# EAGLE schematic Zigzag ISP connector (EAGLE 7.6.0)
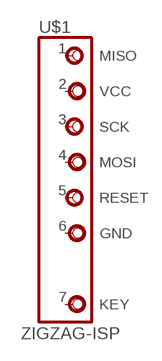
[diagram p0: schematic, sheet 1]

## Parts
U$1  ZIGZAG-ISP  ZIGZAG-ISP'  [ZIGZAG-ISP]
Unconnected: U$1.1(MISO) U$1.2(VCC) U$1.3(SCK) U$1.4(MOSI) U$1.5(RESET) U$1.6(GND) U$1.7(KEY)

## Library data of the parts
U$1 = Albert:ZIGZAG-ISP